# Altium schematic sheet 006_FPGA_DDRII.SchDoc
size B; SheetNumber: 6; SheetTotal: 13
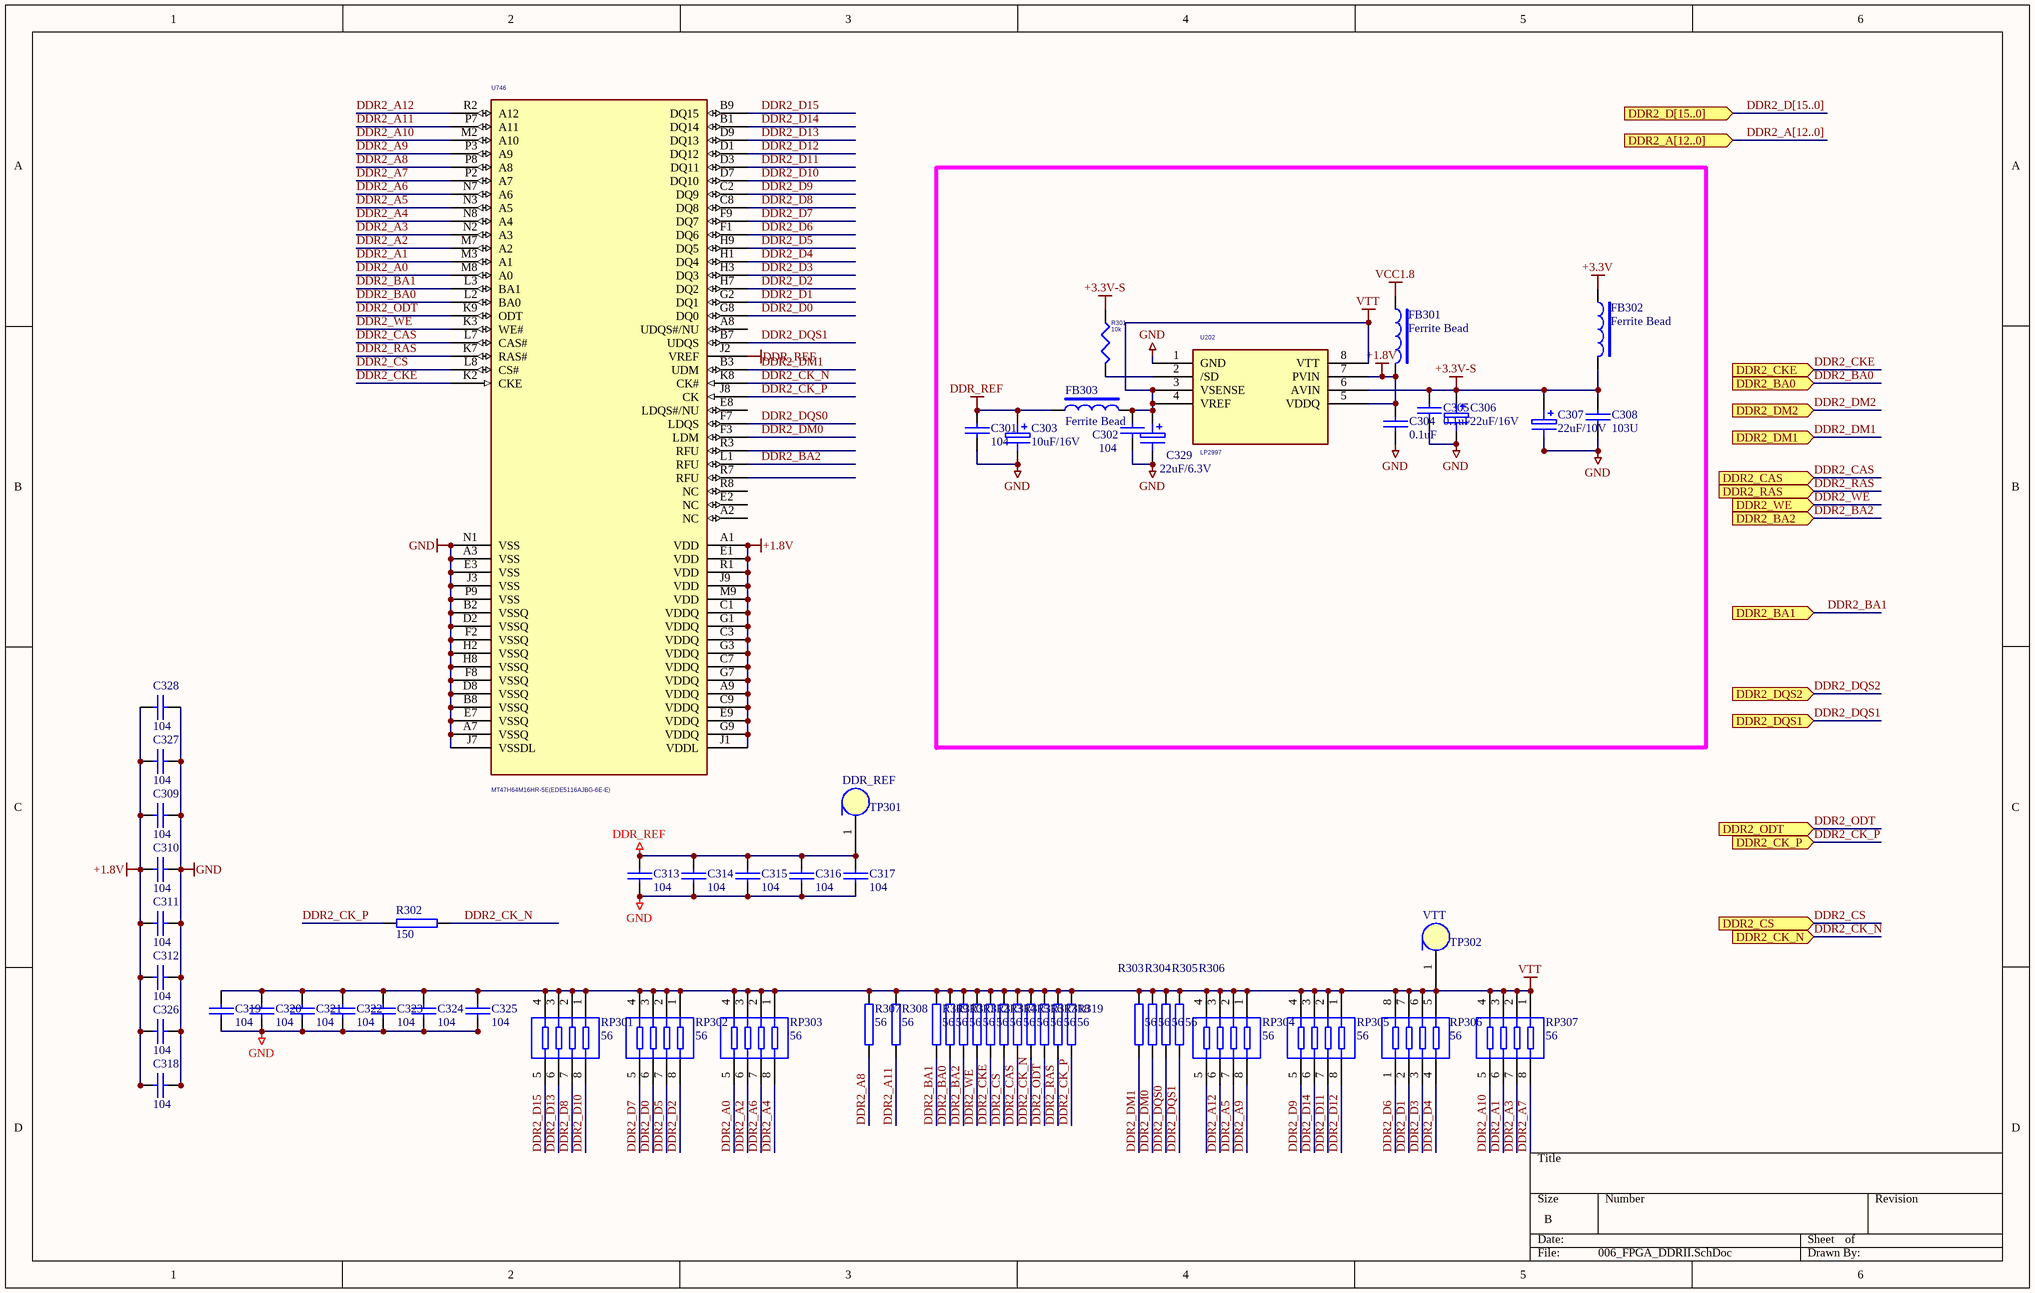
[diagram p0: 006_FPGA_DDRII.SchDoc]

## Parts
C301  104  [C0402]
C302  104  [C0402]
C303  10uF/16V  [C3528]
C304  0.1uF  [C0402]
C305  0.1uF  [C0402]
C306  22uF/16V  [C3528]
C307  22uF/10V  [C3528]
C308  103U  [C0402]
C309  104  [C0402]
C310  104  [C0402]
C311  104  [C0402]
C312  104  [C0402]
C313  104  [C0402]
C314  104  [C0402]
C315  104  [C0402]
C316  104  [C0402]
C317  104  [C0402]
C318  104  [C0402]
C319  104  [C0402]
C320  104  [C0402]
C321  104  [C0402]
C322  104  [C0402]
C323  104  [C0402]
C324  104  [C0402]
C325  104  [C0402]
C326  104  [C0402]
C327  104  [C0402]
C328  104  [C0402]
C329  22uF/6.3V  [C3528]
FB301  Ferrite Bead  [FB0805]
FB302  Ferrite Bead  [FB0805]
FB303  Ferrite Bead  [FB0805]
R301  10k  [R0402]
R302  150  [R0402]
R303  56  [R0402]
R304  56  [R0402]
R305  56  [R0402]
R306  56  [R0402]
R307  56  [R0402]
R308  56  [R0402]
R309  56  [R0402]
R310  56  [R0402]
R311  56  [R0402]
R312  56  [R0402]
R313  56  [R0402]
R314  56  [R0402]
R315  56  [R0402]
R316  56  [R0402]
R317  56  [R0402]
R318  56  [R0402]
R319  56  [R0402]
RP301  56  [RP0603]
RP302  56  [RP0603]
RP303  56  [RP0603]
RP304  56  [RP0603]
RP305  56  [RP0603]
RP306  56  [RP0603]
RP307  56  [RP0603]
TP301  DDR_REF  [PIN-TP2]
TP302  VTT  [PIN-TP2]
U202  LP2997  [SOIC8]
U746  MT47H64M16HR-5E(EDE5116AJBG-6E-E)  [BGA84-0.8]

## Ports
DDR2_A[12..0], DDR2_BA0, DDR2_BA1, DDR2_BA2, DDR2_CAS, DDR2_CK_N, DDR2_CK_P, DDR2_CKE, DDR2_CS, DDR2_D[15..0], DDR2_DM1, DDR2_DM2, DDR2_DQS1, DDR2_DQS2, DDR2_ODT, DDR2_RAS, DDR2_WE

## Nets
+1.8V: C304.2 C309.1 C310.1 C311.1 C312.1 C318.1 C326.1 C327.1 C328.1 FB301.2 U202.5(VDDQ) U202.7(PVIN) U746.A1(VDD) U746.A9(VDDQ) U746.C1(VDDQ) U746.C3(VDDQ) U746.C7(VDDQ) U746.C9(VDDQ) U746.E1(VDD) U746.E9(VDDQ) U746.G1(VDDQ) U746.G3(VDDQ) U746.G7(VDDQ) U746.G9(VDDQ) U746.J1(VDDL) U746.J9(VDD) U746.M9(VDD) U746.R1(VDD)
+3.3V: FB302.1
+3.3V-S: C305.1 C306.1 C307.1 C308.1 FB302.2 R301.1 U202.6(AVIN)
DDR_REF: C301.2 C303.1 C313.2 C314.2 C315.2 C316.2 C317.2 FB303.1 TP301.1 U746.J2(VREF)
GND: C301.1 C302.1 C303.2 C304.1 C305.2 C306.2 C307.2 C308.2 C309.2 C310.2 C311.2 C312.2 C313.1 C314.1 C315.1 C316.1 C317.1 C318.2 C319.1 C320.1 C321.1 C322.1 C323.1 C324.1 C325.1 C326.2 C327.2 C328.2 C329.2 U202.1(GND) U746.A3(VSS) U746.A7(VSSQ) U746.B2(VSSQ) U746.B8(VSSQ) U746.D2(VSSQ) U746.D8(VSSQ) U746.E3(VSS) U746.E7(VSSQ) U746.F2(VSSQ) U746.F8(VSSQ) U746.H2(VSSQ) U746.H8(VSSQ) U746.J3(VSS) U746.J7(VSSDL) U746.N1(VSS) U746.P9(VSS)
VCC1.8: FB301.1
VTT: C302.2 C319.2 C320.2 C321.2 C322.2 C323.2 C324.2 C325.2 C329.1 FB303.2 R303.2 R304.2 R305.2 R306.2 R307.2 R308.2 R309.2 R310.2 R311.2 R312.2 R313.2 R314.2 R315.2 R316.2 R317.2 R318.2 R319.2 RP301.1 RP301.2 RP301.3 RP301.4 RP302.1 RP302.2 RP302.3 RP302.4 RP303.1 RP303.2 RP303.3 RP303.4 RP304.1 RP304.2 RP304.3 RP304.4 RP305.1 RP305.2 RP305.3 RP305.4 RP306.5 RP306.6 RP306.7 RP306.8 RP307.1 RP307.2 RP307.3 RP307.4 TP302.1 U202.3(VSENSE) U202.4(VREF) U202.8(VTT)
DDR2_A0: RP303.5 U746.M8(A0)
DDR2_A1: RP307.6 U746.M3(A1)
DDR2_A2: RP303.6 U746.M7(A2)
DDR2_A3: RP307.7 U746.N2(A3)
DDR2_A4: RP303.8 U746.N8(A4)
DDR2_A5: RP304.7 U746.N3(A5)
DDR2_A6: RP303.7 U746.N7(A6)
DDR2_A7: RP307.8 U746.P2(A7)
DDR2_A8: R307.1 U746.P8(A8)
DDR2_A9: RP304.8 U746.P3(A9)
DDR2_A10: RP307.5 U746.M2(A10)
DDR2_A11: R308.1 U746.P7(A11)
DDR2_A12: RP304.6 U746.R2(A12)
DDR2_BA0: R310.1 U746.L2(BA0) ; port DDR2_BA0
DDR2_BA1: R309.1 U746.L3(BA1) ; port DDR2_BA1
DDR2_BA2: R311.1 U746.L1(RFU) ; port DDR2_BA2
DDR2_CAS: R315.1 U746.L7(CAS#) ; port DDR2_CAS
DDR2_CK_N: R302.2 R316.1 U746.K8(CK#) ; port DDR2_CK_N
DDR2_CK_P: R302.1 R319.1 U746.J8(CK) ; port DDR2_CK_P
DDR2_CKE: R313.1 U746.K2(CKE) ; port DDR2_CKE
DDR2_CS: R314.1 U746.L8(CS#) ; port DDR2_CS
DDR2_D0: RP302.6 U746.G8(DQ0)
DDR2_D1: RP306.2 U746.G2(DQ1)
DDR2_D2: RP302.8 U746.H7(DQ2)
DDR2_D3: RP306.3 U746.H3(DQ3)
DDR2_D4: RP306.4 U746.H1(DQ4)
DDR2_D5: RP302.7 U746.H9(DQ5)
DDR2_D6: RP306.1 U746.F1(DQ6)
DDR2_D7: RP302.5 U746.F9(DQ7)
DDR2_D8: RP301.7 U746.C8(DQ8)
DDR2_D9: RP305.5 U746.C2(DQ9)
DDR2_D10: RP301.8 U746.D7(DQ10)
DDR2_D11: RP305.7 U746.D3(DQ11)
DDR2_D12: RP305.8 U746.D1(DQ12)
DDR2_D13: RP301.6 U746.D9(DQ13)
DDR2_D14: RP305.6 U746.B1(DQ14)
DDR2_D15: RP301.5 U746.B9(DQ15)
DDR2_DM0: R304.1 U746.F3(LDM)
DDR2_DM1: R303.1 U746.B3(UDM) ; port DDR2_DM1
DDR2_DM2: port DDR2_DM2
DDR2_DQS0: R305.1 U746.F7(LDQS)
DDR2_DQS1: R306.1 U746.B7(UDQS) ; port DDR2_DQS1
DDR2_DQS2: port DDR2_DQS2
DDR2_ODT: R317.1 U746.K9(ODT) ; port DDR2_ODT
DDR2_RAS: R318.1 U746.K7(RAS#) ; port DDR2_RAS
DDR2_WE: R312.1 U746.K3(WE#) ; port DDR2_WE
NetR301_2: R301.2 U202.2(/SD)

Not connected (* = marked no-connect by the designer): RP304 5; U746 A2(NC) A8(UDQS#/NU) E2(NC) E8(LDQS#/NU) R3(RFU) R7(RFU) R8(NC)

## Buses and harness runs
bus DDR2_A[12..0] = port DDR2_A[12..0]
bus DDR2_D[15..0] = port DDR2_D[15..0]

## Library data of the parts
C301 C302 C309-C328 = CAP: Capacitor
C303 C306 C329 = ELECTRO1: Part Field 1: 0; Part Field 2: 0
C304 C305 C308 = CAP
C307 = ELECTRO1
FB301-FB303 = INDUCTOR2: Part Field 1: 0; Part Field 10: 100u; Part Field 2: 0; Part Field 3: 0; Part Field 4: 0; Part Field 5: 1; Part Field 6: 0; Part Field 7: 100n; Part Field 8: 100n; Part Field 9: 50u
R301 = R: REUSE_ID: 73
R302-R319 = RES2
RP301-RP307 = RESPACK4
TP301 TP302 = TP1
U202 = LP2997: REUSE_ID: 66
U746 = EDE2516ABSE-6E-E: REUSE_ID: 50